# EAGLE design p0b-001 (EAGLE 9.6.2)
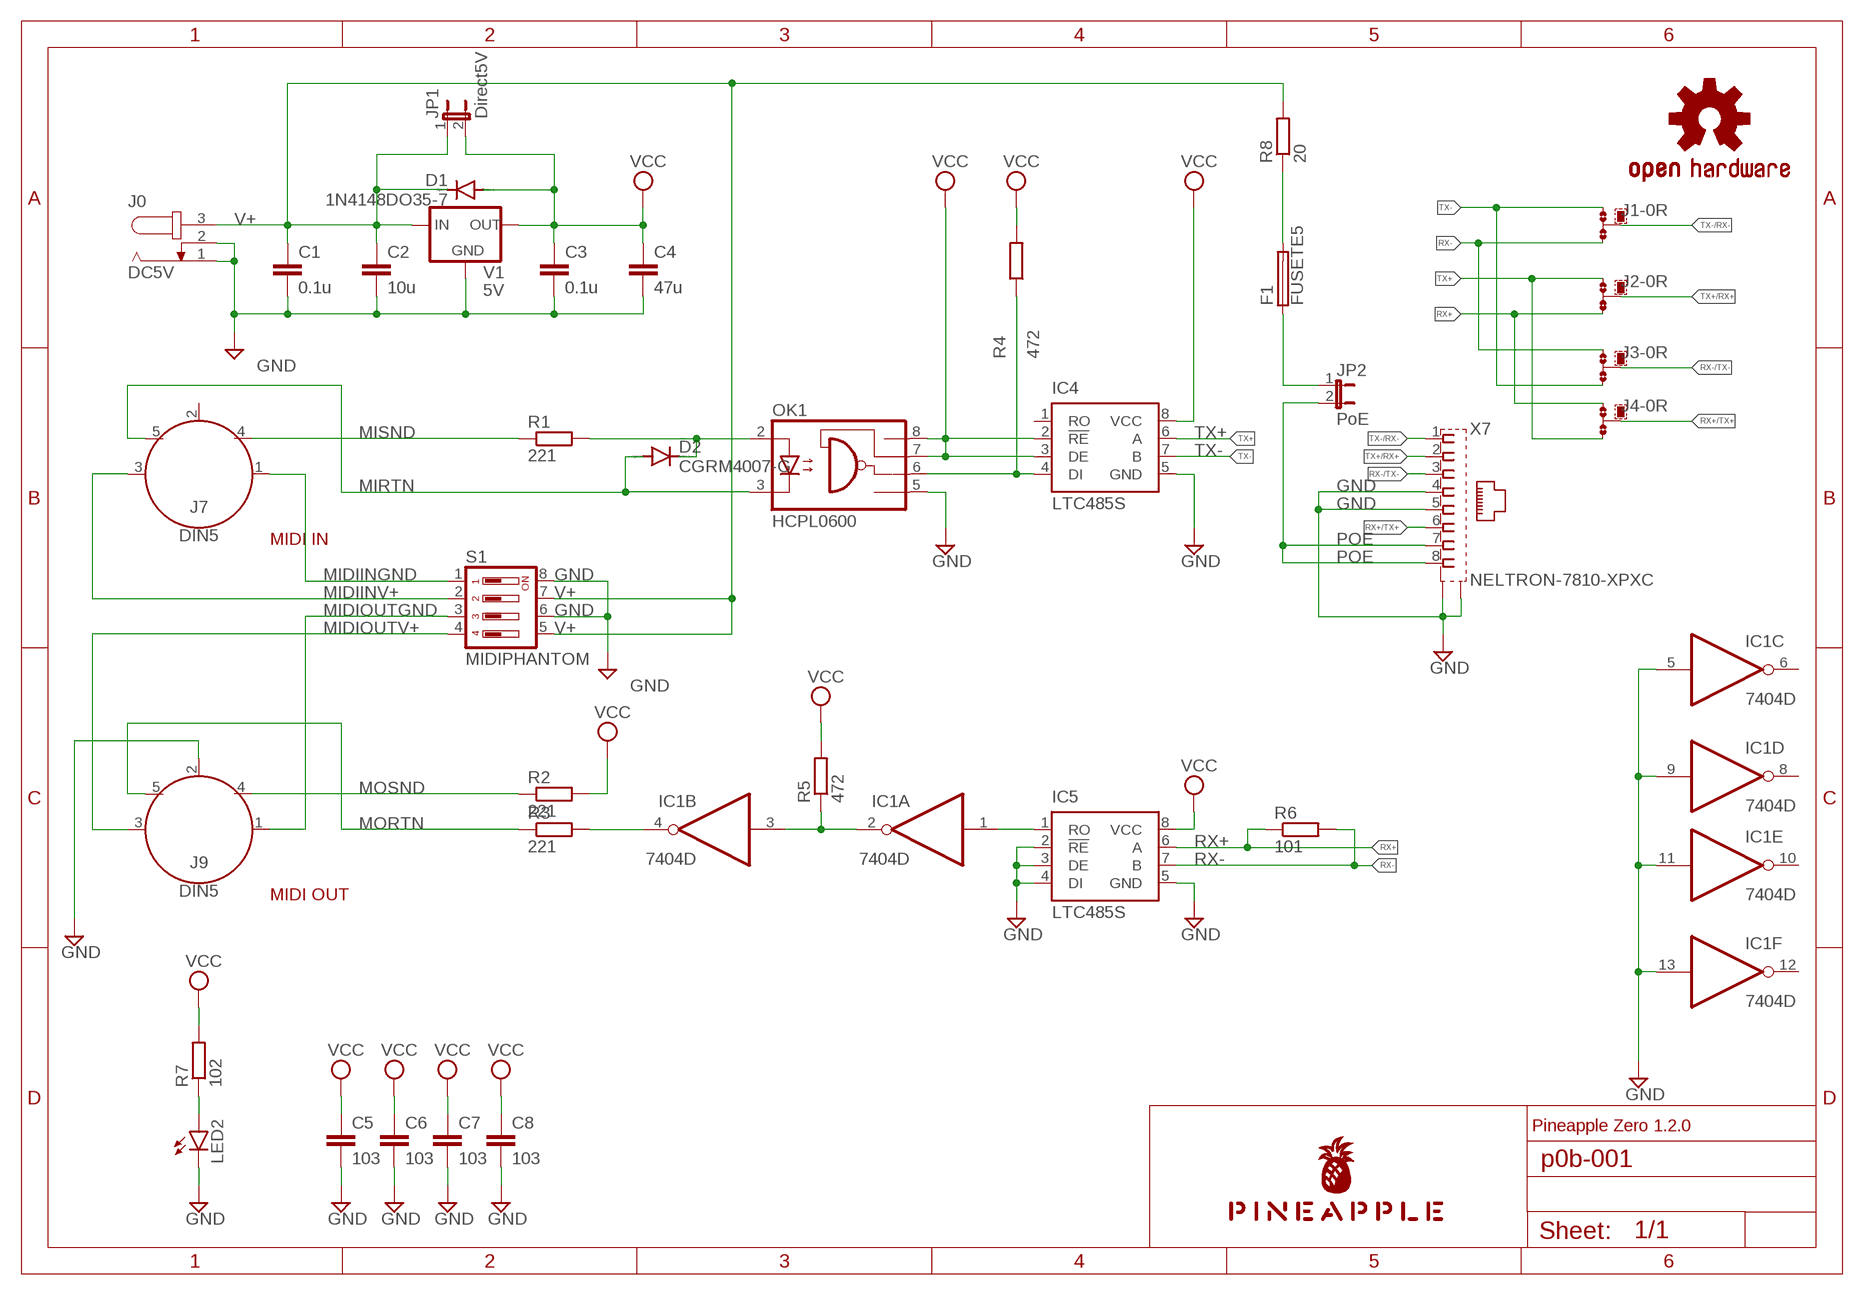
[diagram p0: schematic, sheet 1]

## Parts
C1  0.1u  C-EU025-025X050  [C025-025X050]
C2  10u  C-EU025-030X050  [C025-030X050]
C3  0.1u  C-EU025-025X050  [C025-025X050]
C4  47u  C-EU025-050X050  [C025-050X050]
C5  103  C-EUC1206  [C1206]
C6  103  C-EUC1206  [C1206]
C7  103  C-EUC1206  [C1206]
C8  103  C-EUC1206  [C1206]
D1  1N4148DO35-7  [DO35-7]
D2  CGRM4007-G  [SOD-123_MINI-SMA]
F1  FUSETE5  [TE5]
IC1  7404D  [SO14]
IC4  LTC485S  [SOIC8]
IC5  LTC485S  [SOIC8]
J0  DC5V  JACK-PLUG0  [SPC4077]
J1  0R-JUMPA  [A0R-JMP]
J2  0R-JUMPA  [A0R-JMP]
J3  0R-JUMPA  [A0R-JMP]
J4  0R-JUMPA  [A0R-JMP]
J7  DIN5  [DIN5-RA-PTH]
J9  DIN5  [DIN5-RA-PTH]
JP1  Direct5V  JP1E  [JP1]
JP2  PoE  JP1E  [JP1]
LED2  LEDCHIPLED_1206  [CHIPLED_1206]
LOGO1  OSHW-LOGOS-COPPER  [OSHW-LOGO-S_COPPER]
OK1  HCPL0600  [SOIC08]
R1  221  R-EU_M2012  [M2012]
R2  221  R-EU_M2012  [M2012]
R3  221  R-EU_M2012  [M2012]
R4  472  R-EU_M2012  [M2012]
R5  472  R-EU_M2012  [M2012]
R6  101  R-EU_M2012  [M2012]
R7  102  R-EU_M2012  [M2012]
R8  20  R-EU_0204/5  [0204/5]
S1  MIDIPHANTOM  DIP04YL  [DIP04YL]
U$1  PINEAPPLE450  [PINEAPPLE450]
V1  5V  78XXS  [78XXS]
X7  NELTRON-7810-XPXC  [NELTRON-7810-XPXC-FOOTPRINT]

## Nets
GND [gnd]: C1.2 C2.2 C3.2 C4.2 C5.2 C6.2 C7.2 C8.2 IC1.5(C:I) IC1.9(D:I) IC1.11(E:I) IC1.13(F:I) IC4.5(GND) IC5.2(!RE) IC5.3(DE) IC5.4(DI) IC5.5(GND) J0.1 J0.2 J9.2 LED2.C OK1.5(GND) S1.6 S1.8 V1.GND X7.4 X7.5 X7.S1 X7.S2
MIDIIN: D2.C OK1.2(A) R1.2
MIDIINGND [gnd]: J7.1 S1.1
MIDIINV+ [pwr]: J7.3 S1.2
MIDIOUT: IC1.4(B:O) R3.2
MIDIOUTGND [gnd]: J9.1 S1.3
MIDIOUTV+ [pwr]: J9.3 S1.4
MIRTN: D2.A J7.5 OK1.3(C)
MISND: J7.4 R1.1
MORTN: J9.5 R3.1
MOSND: J9.4 R2.1
N$4: LED2.A R7.1
NMIDIOUT: IC1.2(A:O) IC1.3(B:I) R5.1
POE [pwr]: JP2.2 X7.7 X7.8
POERAW [pwr]: F1.1 JP2.1
POERAW2 [pwr]: F1.2 R8.1
RX: IC1.1(A:I) IC5.1(RO)
RX+: IC5.6(A) J2.3 J4.1 R6.1
RX+/TX+: J4.2 X7.6
RX-: IC5.7(B) J1.3 J3.1 R6.2
RX-/TX-: J3.2 X7.3
TX: IC4.4(DI) OK1.6(VO) R4.1
TX+: IC4.6(A) J2.1 J4.3
TX+/RX+: J2.2 X7.2
TX-: IC4.7(B) J1.1 J3.3
TX-/RX-: J1.2 X7.1
V+ [pwr]: C1.1 C2.1 D1.C J0.3 JP1.1 R8.2 S1.5 S1.7 V1.IN
VCC [pwr]: C3.1 C4.1 C5.1 C6.1 C7.1 C8.1 D1.A IC4.2(!RE) IC4.3(DE) IC4.8(VCC) IC5.8(VCC) JP1.2 OK1.7(VE) OK1.8(VCC) R2.2 R4.2 R5.2 R7.2 V1.OUT
Unconnected: IC1.6(C:O) IC1.8(D:O) IC1.10(E:O) IC1.12(F:O) IC4.1(RO) J7.2

## Notes on the sheet
- MIDI IN
- MIDI OUT
- Pineapple Zero 1.2.0

## Power pins joined to a net without a drawn wire
GND: IC1.7(P:GND)
VCC: IC1.14(P:VCC)

## Library data of the parts
C1-C8 = rcl:C-EU: CAPACITOR, European symbol; SPICEPREFIX: C
D1 = diode:1N4148: DIODE high speed (Philips)
D2 = diode:CGRM400*-G: Molded plasitc,JEDEC SOD-123/Mini SMA Source: Comchip CGRM4001-G.pdf
F1 = fuse:FUSE: Fuse; OC_FARNELL: unknown; OC_NEWARK: unknown
IC1 = 74xx-us:74*04: Hex INVERTER
IC4 IC5 = linear-technology:LTC485: Low Power RS485 Interface Transceiver Source: http://www.linear.com/pc/downloadDocument.do?navId=H0,C1,C1007,C1017,P2064,D1718; OC_FARNELL: unknown; OC_NEWARK: unknown
J0 = con-jack:JACK-PLUG: DC POWER JACK Power Jack, DC, Right Angle, Through Hole, Rated 5A at 16VDC, PC Terminals Distributor: Farnell (www.Farnell.de) Drawing: 84N1161.pdf / 84N1162.pdf Manufacturer: SPC Technology (www.spctechnology.com) Type: SPC4077 / SPC 4078; OC_FARNELL: unknown; OC_NEWARK: unknown
J1-J4 = jump-0r-smd:0R-JUMP: SMD 0R 0805 Jumper
J7 J9 = SparkFun-Connectors:DIN5: DIN5 Connector - Female Right Angle (frequently used as a MIDI Jack connector) This type of connector and cable is frequently used for transmitting midi data (musical instrument digital interface). It is what you usually see on a keyboard or set of electronic drums. Learn more here <https://en.wikipedia.org/wiki/MIDI>. For more information on the pinout and electrical specifications of MIDI communications, please see the following resource: https://www.midi.org/specifications/item/midi-din-electrical-specification Here is the connector we sell at SparkFun: MIDI Connector - Female Right Angle <https://www.sparkfun.com/products/9536> (PRT-09536) Datasheet <hhttp://www.sparkfun.com/datasheets/Prototyping/Connectors/MIDI-RA.pdf> It is used on this SparkFun product: SparkFun MIDI Shield <https://www.sparkfun.com/products/12898> (DEV-12898); PROD_ID: CONN-09481
JP1 JP2 = jumper:JP1E: JUMPER
LED2 = led:LED: LED OSRAM: - CHIPLED LG R971, LG N971, LY N971, LG Q971, LY Q971, LO R971, LY R971 LH N974, LH R974 LS Q976, LO Q976, LY Q976 LO Q996 - Hyper CHIPLED LW Q18S LB Q993, LB Q99A, LB R99A - SideLED LS A670, LO A670, LY A670, LG A670, LP A670 LB A673, LV A673, LT A673, LW A673 LH A674 LY A675 LS A676, LA A676, LO A676, LY A676, LW A676 LS A679, LY A679, LG A679 - Hyper Micro SIDELED® LS Y876, LA Y876, LO Y876, LY Y876 LT Y87S - SmartLED LW L88C, LW L88S LB L89C, LB L89S, LG L890 LS L89K, LO L89K, LY L89K LS L896, LA L896, LO L896, LY L896 - TOPLED LS T670, LO T670, LY T670, LG T670, LP T670 LSG T670, LSP T670, LSY T670, LOP T670, LYG T670 LG T671, LOG T671, LSG T671 LB T673, LV T673, LT T673, LW T673 LH T674 LS T676, LA T676, LO T676, LY T676, LB T676, LH T676, LSB T676, LW T676 LB T67C, LV T67C, LT T67C, LS T67K, LO T67K, LY T67K, LW E67C LS E67B, LA E67B, LO E67B, LY E67B, LB E67C, LV E67C, LT E67C LW T67C LS T679, LY T679, LG T679 LS T770, LO T770, LY T770, LG T770, LP T770 LB T773, LV T773, LT T773, LW T773 LH T774 LS E675, LA E675, LY E675, LS T675 LS T776, LA T776, LO T776, LY T776, LB T776 LHGB T686 LT T68C, LB T68C - Hyper Mini TOPLED® LB M676 - Mini TOPLED Santana® LG M470 LS M47K, LO M47K, LY M47K Source: http://www.osram.convergy.de LUXEON: - LUMILED® LXK2-PW12-R00, LXK2-PW12-S00, LXK2-PW14-U00, LXK2-PW14-V00 LXK2-PM12-R00, LXK2-PM12-S00, LXK2-PM14-U00 LXK2-PE12-Q00, LXK2-PE12-R00, LXK2-PE12-S00, LXK2-PE14-T00, LXK2-PE14-U00 LXK2-PB12-K00, LXK2-PB12-L00, LXK2-PB12-M00, LXK2-PB14-N00, LXK2-PB14-P00, LXK2-PB14-Q00 LXK2-PR12-L00, LXK2-PR12-M00, LXK2-PR14-Q00, LXK2-PR14-R00 LXK2-PD12-Q00, LXK2-PD12-R00, LXK2-PD12-S00 LXK2-PH12-R00, LXK2-PH12-S00 LXK2-PL12-P00, LXK2-PL12-Q00, LXK2-PL12-R00 Source: www.luxeon.com KINGBRIGHT: KA-3528ASYC Source: www.kingbright.com
LOGO1 = SparkFun-Aesthetics:OSHW-LOGO: Open-Source Hardware (OSHW) Logo This logo indicates the piece of hardware it is found on incorporates a OSHW license and/or adheres to the definition of open source hardware found here: http://freedomdefined.org/OSHW
OK1 = optocoupler:HCPL0600: HEWLETT PACKARD OPTO COUPLER; MF: AGILENT TECHNOLOGIES; MPN: HCPL-0600-000E; OC_FARNELL: 9994696; OC_NEWARK: 88H7774
R1-R8 = rcl:R-EU_: RESISTOR, European symbol; SPICEPREFIX: R
S1 = switch-dil:DIP04YL: DIL/CODE SWITCH; OC_FARNELL: unknown; OC_NEWARK: unknown
U$1 = pineapple:PINEAPPLE450
V1 = v-reg:78XXS: VOLTAGE REGULATOR
X7 = con-rj45:NELTRON-7810-XPXC: Mod. Jack, Right Angle, 8 posiotion, 8 contatcs RJ45 Source: GLX-S-88M.pdf

## Net classes
0 default: width 0.152 mm, drill 0.152 mm, clearance 0.152 mm
1 pwr: width 0.305 mm, drill 0.152 mm, clearance 0.152 mm
2 gnd: width 0.305 mm, drill 0.152 mm, clearance 0.152 mm

## Board
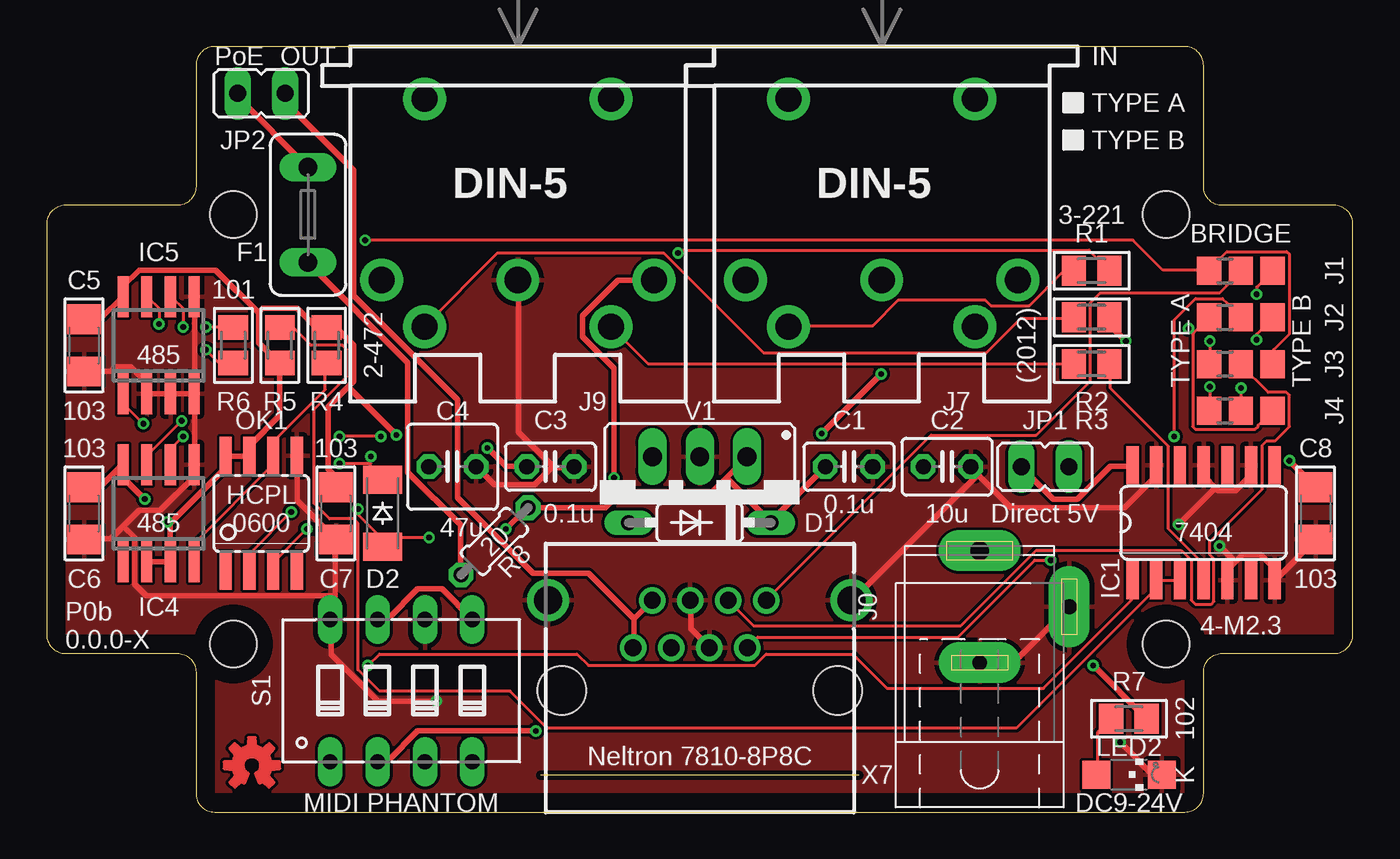
[diagram p1: board, top side]
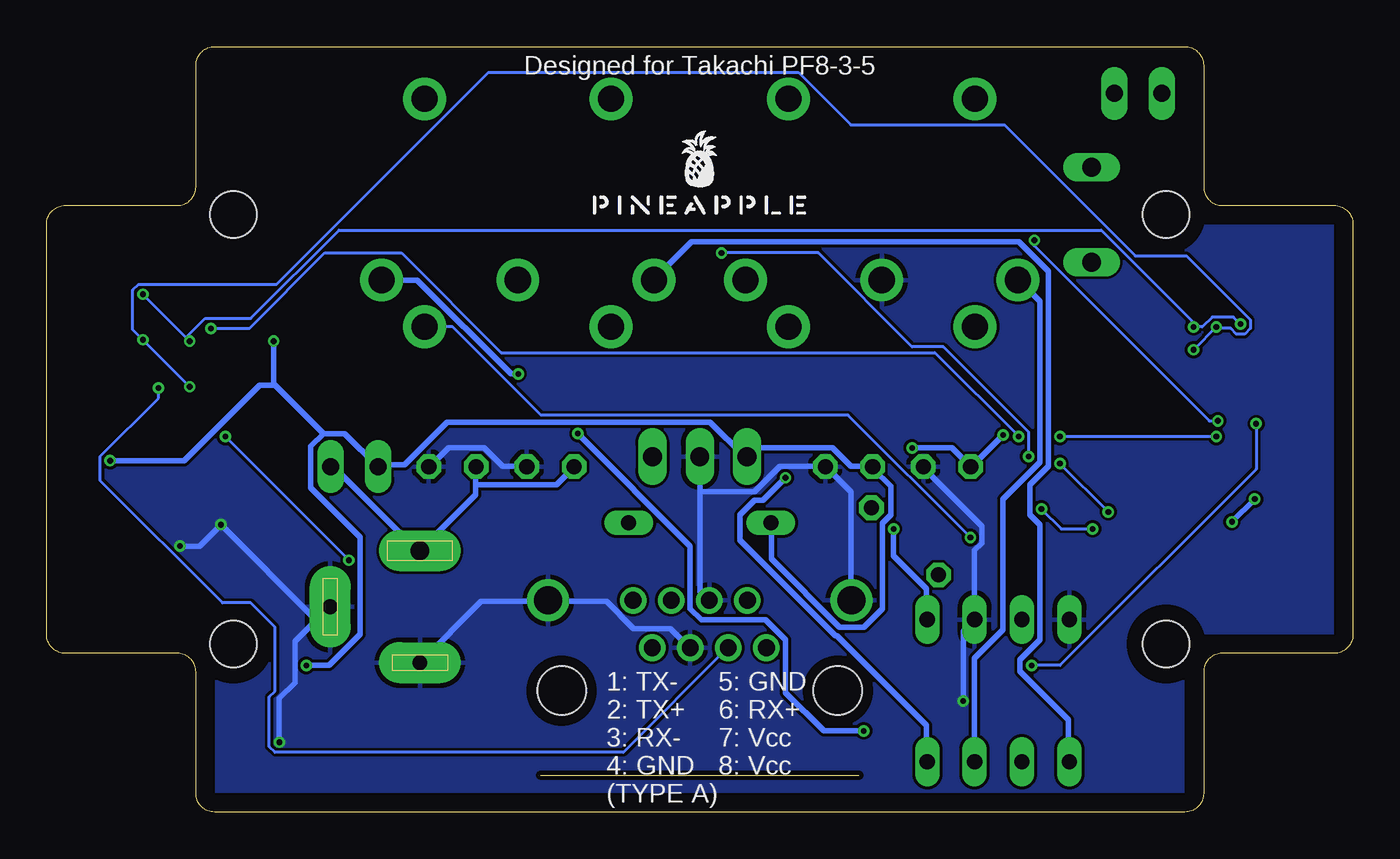
[diagram p2: board, bottom side, seen from below]

Size 70 x 41 mm. Coordinates in mm from the lower left corner, seen from the top.
Outline: 1,8.5 7,8.5 arc-90 8,7.5 8,1 arc90 9,0 61,0 arc90 62,1 62,7.5 arc-90 63,8.5 69,8.5 arc90 70,9.5 70,31.5 arc90 69,32.5 63,32.5 arc-90 62,33.5 62,40 arc90 61,41 9,41 arc90 8,40 8,33.5 arc-90 7,32.5 1,32.5 arc90 0,31.5 0,9.5 arc90 1,8.5
Copper layers (1*16): Top 0.035mm / dielectric 1.5mm / Bottom 0.035mm
Design rules "SeeedStudio_2layer_DRU_no_angle_20140221": minimum track width 6mil, minimum drill 12mil, track to track 6mil, track to pad 6mil, pad to pad 6mil, via to via 6mil, smd to smd 0mil, copper to edge 10mil, drill to drill 10mil, minimum pad ring 10mil, minimum via ring 6mil, stop-mask expansion 2mil, vias tented up to drill 100mil, thermal gap 10mil
Holes 2.5 mm at 10,9 60,9 60,32 10,32
tRestrict: area 0,8.5 to 1,32.5; area 0,31.5 to 9,32.5; area 8,31.5 to 9,41; area 8,40 to 62,41; area 61,31.5 to 62,41; area 61,31.5 to 70,32.5; area 69,8.5 to 70,32.5; area 61,8.5 to 70,9.5; area 61,0 to 62,9.5; area 8,0 to 62,1; area 8,0 to 9,9.5; area 0,8.5 to 9,9.5; 4 more areas
bRestrict: area 8,40 to 62,41; area 69,8.5 to 70,32.5; area 8,0 to 62,1; area 0,8.5 to 1,32.5; area 8,7 to 12,11; area 8,31.5 to 9,41; area 61,31.5 to 62,41; area 8,0 to 9,9.5; area 61,0 to 62,9.5; area 0,31.5 to 9,32.5; area 0,8.5 to 9,9.5; area 61,8.5 to 70,9.5; 5 more areas

### Footprints (pad centres in the part's own frame; a part is rotated, then mirrored left to right if it is on the bottom)
C025-025X050 = drill 0.813 octagon: 1 -1.27,0; 2 1.27,0
C025-030X050 = drill 0.813 octagon: 1 -1.27,0; 2 1.27,0
C025-050X050 = drill 0.813 octagon: 1 -1.27,0; 2 1.27,0
C1206 = smd 1.6 x 1.8: 1 -1.4,0; 2 1.4,0
DO35-7 = drill 0.813 long: A 3.81,0; C -3.81,0
SOD-123_MINI-SMA = smd 1.5 x 2.1: A 1.8,0; C -1.8,0
TE5 = drill 1.016 long: 1 -2.54,0; 2 2.54,0
SO14 = smd 0.66 x 2.032: 1 -3.81,-3.073; 2 -2.54,-3.073; 3 -1.27,-3.073; 4 0,-3.073; 5 1.27,-3.073; 6 2.54,-3.073; 7 3.81,-3.073; 8 3.81,3.073; 9 2.54,3.073; 10 1.27,3.073; 11 0,3.073; 12 -1.27,3.073; 13 -2.54,3.073; 14 -3.81,3.073
SOIC8 = smd 0.6 x 2.2: 1 -1.905,-2.6; 2 -0.635,-2.6; 3 0.635,-2.6; 4 1.905,-2.6; 5 1.905,2.6; 6 0.635,2.6; 7 -0.635,2.6; 8 -1.905,2.6
SPC4077 = drill 0.8 pad 2.184 long: 1 -3,0; 2 0,-4.8 | drill 1 pad 2.184 long: 3 3,0
A0R-JMP = smd 1.5 x 1.3: 1 0,1.7; 2 0,0; 3 0,-1.7
DIN5-RA-PTH = drill 1.4 pad 2.286: 1 7.3,12.5; 2 0,12.5; 3 -7.3,12.5; 4 5,15; 5 -5,15; 6 -5,2.8; 7 5,2.8
JP1 = drill 0.914 long: 1 0,-1.27; 2 0,1.27
CHIPLED_1206 = smd 1.5 x 1.5: A 0,-1.75; C 0,1.75
SOIC08 = smd 0.66 x 2.032: 1 -1.905,-3.073; 2 -0.635,-3.073; 3 0.635,-3.073; 4 1.905,-3.073; 5 1.905,3.073; 6 0.635,3.073; 7 -0.635,3.073; 8 -1.905,3.073
M2012 = smd 1.3 x 1.6: 1 -0.95,0; 2 0.95,0
0204/5 = drill 0.813 octagon: 1 -2.54,0; 2 2.54,0
DIP04YL = drill 0.813 long: 1 -3.81,-3.81; 2 -1.27,-3.81; 3 1.27,-3.81; 4 3.81,-3.81; 5 3.81,3.81; 6 1.27,3.81; 7 -1.27,3.81; 8 -3.81,3.81
78XXS = drill 1.016 long: GND 0,-2.54; IN -2.54,-2.54; OUT 2.54,-2.54
NELTRON-7810-XPXC-FOOTPRINT = drill 0.9 pad 1.422: 1 -3.57,-4.84; 2 -2.55,-2.3; 3 -1.53,-4.84; 4 -0.51,-2.3; 5 0.51,-4.84; 6 1.53,-2.3; 7 2.55,-4.84; 8 3.57,-2.3 | drill 1.5 pad 2.184: S1 -8.125,-4.84; S2 8.125,-4.84 | hole 2.6: -7.4,0; 7.4,0

### Placement (x,y rotation side)
C1  43,18.5 0 top
C2  48.25,18.5 0 top
C3  27,18.5 0 top
C4  21.75,18.5 0 top
C5  2,25 270 top
C6  2,16 270 top
C7  15.5,16 270 top
C8  68,16 270 top
D1  35,15.5 180 top
D2  18,16 270 top
F1  14,32 270 top
IC1  62,15.5 0 top
IC4  6,16 0 top
IC5  6,25 0 top
J0  50,11 90 top
J1  64,29 90 top
J2  64,26.5 90 top
J3  64,24 90 top
J4  64,21.5 90 top
J7  44.75,41 180 top
J9  25.25,41 180 top
JP1  53.5,18.5 90 top
JP2  11.5,38.5 270 top
LED2  58,2 270 top
LOGO1  11,2.5 0 top
OK1  11.5,16 0 top
R1  56,29 0 top
R2  56,26.5 0 top
R3  56,24 0 top
R4  15,25 90 top
R5  12.5,25 270 top
R6  10,25 90 top
R7  58,5 0 top
R8  24,14.5 45 top
S1  19,6.5 0 top
U$1  35,32 0 bottom
V1  35,16.5 180 top
X7  35,6.5 180 top

### Tracks (layer width: path | path; a pad name or v marks a point on that pad's centre or on a via)
GND  (via drill 0.3)
  Top 0.305: IC1.13 59.44,18.52 59.44,17.98 57.76,16.31 51.66,16.31 49.53,18.44 C2.2 49.84,17.98 43.13,11.28 X7.S1 | C8.2 67.97,14.55 65.84,12.42 IC1.7 66.06,12.8 65.08,13.79 64.08,13.79 63.7,13.41 | 63.7,13.41 63.32,13.03 63.32,12.5 IC1.5 | 62.64,17.37 62.79,17.22 63.7,17.22 64.47,17.98 64.47,18.52 IC1.9 | 62.64,17.37 62.03,17.98 62.03,18.52 IC1.11 | v57.53,3.73 59.21,2.06 59.74,2.06 LED2.C | v60.66,15.39 62.64,17.37 | v62.87,14.25 63.7,13.41 | J0.1 50.06,8 51.82,8 54.79,10.97 J0.2 | S1.8 15.24,10.36 15.47,10.59 15.47,14.55 C7.2 15.39,14.71 13.41,16.69 13.41,19.05 OK1.5 | 4.12,15.32 4.95,16.15 6.1,16.15 7.85,17.91 7.85,18.59 IC4.5 7.92,18.75 7.92,22.25 IC5.4 | 4.12,15.32 3.43,14.63 2.06,14.63 C6.2 | C5.2 2.06,23.62 3.43,23.62 3.66,23.85 4.5,23.85 5.33,23.01 5.33,22.4 IC5.2 5.49,22.4 6.55,22.4 IC5.3 6.71,22.4 7.85,22.4 IC5.4 | IC5.5 7.92,27.58 7.92,22.48 IC5.4 | 4.12,15.32 4.72,14.71 4.72,12.19 5.33,11.58 15.39,11.58 S1.8 | X7.5 34.52,11.28 34.52,9.83 35.51,8.84 X7.4 | 27.13,18.44 27.05,18.44 26.14,17.53 24,17.53 23.09,18.44 C4.2 | 27.13,18.44 28.19,18.44 C3.2 | J9.2 25.3,28.5 25.3,20.34 27.13,18.52 27.13,18.44 | v20.88,5.94 17.75,5.94 15.24,8.46 15.24,10.21 S1.8
  Bottom 0.305: C1.2 44.27,18.52 45.57,18.52 46.56,19.51 48.46,19.51 49.45,18.52 C2.2 | v57.53,3.73 57.53,6.1 56.69,6.93 56.69,9.14 54.86,10.97 J0.2 55.63,10.36 v60.66,15.39 61.8,14.25 v62.87,14.25 | J0.1 49.99,8 46.71,11.28 43.13,11.28 X7.S1 42.98,11.28 40.01,11.28 38.56,9.83 36.58,9.83 35.59,8.84 X7.4 | 34.98,17.14 34.98,11.81 34.52,11.35 X7.5 | 34.98,17.14 34.98,18.97 V1.GND | C4.2 23.01,18.44 19.89,15.32 19.89,14.4 20.27,14.02 20.27,10.36 S1.6 20.34,10.21 20.88,9.68 v20.88,5.94 | X7.S2 26.9,11.35 26.9,17.14 28.19,18.44 C3.2 28.42,18.52 30.71,18.52 32.08,17.14 34.98,17.14
  pour Top: -0.5,-0.5 70.5,-0.5 70.5,41.5 -0.5,41.5
  pour Bottom: -1,-1 71,-1 71,42 -1,42
MIDIIN  (via drill 0.3)
  Top 0.152: v33.83,29.95 33.98,30.1 55.85,30.1 56.92,29.03 R1.2 | 17.37,18.67 17.37,18.44 17.98,17.83 D2.C | 17.37,18.67 v17.37,19.05 | v13.11,16.08 10.9,13.87 10.9,12.95 OK1.2 | 17.37,18.67 v15.7,18.67
  Bottom 0.152: v33.83,29.95 28.65,29.95 23.62,24.92 21.95,24.92 17.37,20.34 v17.37,19.05 | v15.7,18.67 v13.11,16.08
MIDIINGND
  Bottom 0.305: S1.1 15.24,2.74 15.24,4.95 17.83,7.54 17.83,8.15 16.76,9.22 16.76,15.39 17.3,15.93 17.3,17.53 16.31,18.52 16.31,28.96 17.91,30.56 35.43,30.56 37.41,28.57 J7.1
MIDIINV+  (via drill 0.3)
  Top 0.305: v26.21,4.34 19.89,4.34 18.29,2.74 17.75,2.74 S1.2 | v44.73,23.47 v41.53,20.27
  Bottom 0.305: v26.21,4.34 28.35,4.34 30.4,6.4 30.4,9.22 31.47,10.29 34.9,10.29 35.51,10.9 35.51,14.25 v41.53,20.27 | v44.73,23.47 45.11,23.47 50.14,28.5 J7.3
MIDIOUT
  Top 0.152: R3.2 57,23.93 57,22.71 60.12,19.58 60.12,15.16 61.95,13.34 61.95,12.5 IC1.4
MIDIOUTGND
  Bottom 0.305: S1.3 20.27,2.74 20.27,8.23 18.75,9.75 18.75,16.76 16.76,18.75 16.76,27.36 17.91,28.5 J9.1
MIDIOUTV+  (via drill 0.3)
  Top 0.305: v30.4,17.91 30.4,23.77 28.73,25.45 28.73,26.59 30.63,28.5 32.54,28.5 J9.3
  Bottom 0.305: v30.4,17.91 31.62,16.69 32.08,16.69 32.84,15.93 32.84,14.55 27.74,9.45 27.66,9.45 22.86,4.65 22.86,2.74 S1.4
MIRTN  (via drill 0.3)
  Top 0.152: v13.95,15.16 12.19,13.41 12.19,12.95 OK1.3 | v16.69,16.23 16.69,15.93 17.98,14.63 17.98,14.25 D2.A 17.98,14.71 v20.5,14.71
  Bottom 0.152: v13.95,15.16 15.62,15.16 v16.69,16.23 | v20.5,14.71 27.05,21.26 43.51,21.26 48.23,25.98 49.68,25.98 J7.5
MISND
  Top 0.152: R1.1 55.02,28.96 54.48,28.96 52.65,27.13 50.6,27.13 50.29,27.43 45.64,27.43 44.27,26.06 39.78,26.06 J7.4
MORTN
  Top 0.152: R3.1 55.02,24 32.23,24 30.25,25.98 J9.5
MOSND
  Top 0.152: R2.1 55.02,26.44 52.2,26.44 50.37,24.61 38.41,24.61 33.07,29.95 24.16,29.95 20.27,26.06 J9.4
N$4
  Top 0.152: LED2.A 56.31,2.06 56.31,4.27 57,4.95 R7.1
NMIDIOUT
  Top 0.152: R5.1 12.57,25.91 13.26,25.91 14.17,24.99 15.85,24.99 16.08,24.77 16.08,23.32 14.33,21.57 14.33,16.54 15.16,15.7 16.46,15.7 16.69,15.47 16.69,7.62 17.83,6.48 24.84,6.48 26.82,4.5 51.97,4.5 59.44,11.96 59.44,12.42 IC1.2 59.51,12.42 60.66,12.42 IC1.3
POE
  Top 0.305: 31.47,10.36 31.47,8.84 X7.8 | 31.47,10.36 32.38,11.28 X7.7 | 31.47,10.36 29.03,12.8 26.06,12.8 22.02,16.84 22.02,22.1 16.46,27.66 16.46,34.37 12.8,38.02 12.8,38.48 JP2.2
POERAW
  Top 0.305: JP2.1 10.29,38.48 10.29,38.25 13.95,34.59 F1.1
POERAW2
  Top 0.305: R8.1 22.17,12.72 22.17,15.39 19.36,18.21 19.36,24.08 14.02,29.41 F1.2
RX  (via drill 0.3)
  Top 0.152: v17.22,7.85 17.83,8.46 28.42,8.46 29.03,7.85 37.95,7.85 38.56,8.46 43.2,8.46 45.03,6.63 53.42,6.63 58.14,11.35 58.14,12.42 IC1.1 | v5.18,20.8 4.12,21.87 4.12,22.33 IC5.1
  Bottom 0.152: v17.22,7.85 15.7,7.85 5.18,18.36 v5.18,20.8
RX+  (via drill 0.3)
  Top 0.152: v8.53,24.77 9.22,24.08 9.98,24.08 R6.1 | v7.32,25.98 7.32,26.98 6.71,27.58 IC5.6 | v62.33,22.78 62.33,21.57 J4.1 | v64.85,25.3 64.85,25.6 65.68,26.44 J2.3
  Bottom 0.152: v8.53,24.77 v7.32,25.98 7.32,25.91 6.55,25.91 6.25,25.6 5.79,25.6 5.49,25.91 5.49,26.36 8.91,29.79 11.66,29.79 18.67,36.8 26.9,36.8 29.72,39.62 46.33,39.62 57.68,28.27 65.08,28.27 65.38,27.96 65.38,25.83 v64.85,25.3 v62.33,22.78
RX+/TX+  (via drill 0.3)
  Top 0.152: v64.01,22.71 64.01,21.57 J4.2
  Bottom 0.152: v64.01,22.71 64.01,22.17 67.13,19.05 67.13,17.75 60.58,11.2 59.05,11.2 57.76,9.91 57.76,6.48 58.06,6.17 58.06,3.5 57.76,3.2 39.09,3.2 33.53,8.76 X7.6
RX-  (via drill 0.3)
  Top 0.152: v8.53,25.98 9.98,25.98 R6.2 | v6.02,26.14 6.02,26.98 5.41,27.58 IC5.7 | v62.33,25.22 62.33,24 J3.1 | v64.85,27.74 64.85,28.12 65.68,28.96 J1.3
  Bottom 0.152: v6.02,26.14 6.4,26.52 7.54,26.52 8.08,25.98 v8.53,25.98 8.53,26.21 13.49,31.17 54.33,31.17 59.05,26.44 61.49,26.44 62.48,25.45 v62.33,25.22 v64.85,27.74
RX-/TX-
  Top 0.152: J3.2 64.01,23.93 65.46,22.48 66.45,22.48 66.6,22.33 66.6,20.65 65.84,19.89 65.38,19.89 65.15,19.66 65.15,17.3 62.33,14.48 62.33,13.79 62.56,13.56 62.56,11.28 62.41,11.12 61.57,11.12 61.34,11.35 61.34,13.49 60.81,14.02 53.03,14.02 49,9.98 37.87,9.98 36.58,11.28 X7.3
TX
  Top 0.152: R4.1 14.94,24 14.94,22.63 12.19,19.89 12.19,19.13 OK1.6 12.12,19.05 12.12,18.59 7.92,14.4 7.92,13.41 IC4.4
TX+  (via drill 0.3)
  Top 0.152: 61.45,25.64 62.26,26.44 J2.1 | 61.45,25.64 61.42,25.6 61.42,20.65 61.57,20.5 64.77,20.5 64.92,20.65 64.92,20.73 65.68,21.49 J4.3 | v7.32,20.12 6.71,19.51 6.71,18.67 IC4.6 | v17.91,20.12 v15.7,20.12 | 61.45,25.64 v61.19,25.91
  Bottom 0.152: v15.7,20.12 v7.32,20.12 | v17.91,20.12 22.4,24.61 45.64,24.61 50.98,29.95 55.09,29.95 59.13,25.91 v61.19,25.91
TX+/RX+  (via drill 0.3)
  Top 0.152: v60.43,20.12 60.43,26.36 61.57,27.51 63.02,27.51 63.25,27.28 63.25,27.2 63.93,26.52 J2.2 | v53.8,13.49 52.96,13.49 48.84,9.37 38.1,9.37 37.57,8.84 X7.2
  Bottom 0.152: v53.8,13.49 v60.43,20.12
TX-  (via drill 0.3)
  Top 0.152: J3.3 65.76,24 65.76,24.77 66.6,25.6 66.6,29.87 66.45,30.02 63.25,30.02 62.26,29.03 J1.1 62.18,29.03 59.82,29.03 58.22,30.63 v17.07,30.63 | v7.24,20.95 5.41,19.13 5.41,18.67 IC4.7
  Bottom 0.152: v7.24,20.95 7.7,20.95 17.07,30.33 v17.07,30.63
TX-/RX-
  Top 0.152: J1.2 63.93,28.96 63.25,28.27 63.25,28.19 62.87,27.81 56.46,27.81 55.93,27.28 55.93,23.09 53.03,20.19 47.4,20.19 38.56,11.35 X7.1
V+  (via drill 0.3)
  Top 0.305: S1.7 17.75,10.36 18.29,10.36 19.89,11.96 21.18,11.96 22.78,10.36 S1.5 | 36.42,17.91 37.49,18.97 V1.IN | 36.42,17.91 35.66,17.14 30.79,17.14 29.95,16.31 25.83,16.31 R8.2 25.68,16.23 v24.61,15.16 | 36.42,17.91 38.79,15.54 D1.C 38.86,15.62 41.68,18.44 C1.1
  Bottom 0.305: 47.02,17.53 47.02,16.99 49.99,14.02 J0.3 50.14,14.02 54.56,18.44 54.71,18.44 JP1.1 | 47.02,17.53 47.02,18.44 C2.1 | v24.61,15.16 24.61,13.72 22.86,11.96 22.86,10.36 S1.5 | 47.02,17.53 42.67,17.53 41.76,18.44 C1.1
VCC  (via drill 0.3)
  Top 0.305: v56.08,7.85 58.9,5.03 R7.2 | v57.84,25.22 57,26.06 57,26.44 R2.2 | v66.6,18.82 67.97,17.45 C8.1 | IC1.14 58.14,18.52 57,18.52 55.24,16.76 53.95,16.76 52.27,18.44 JP1.2 | C5.1 2.06,26.44 2.9,26.44 4.04,27.58 IC5.8 4.12,27.74 4.12,28.19 4.95,29.03 9.07,29.03 11.35,26.75 | C6.1 2.06,17.45 2.9,17.45 4.04,18.59 IC4.8 3.81,18.21 v5.26,16.76 | IC4.2 5.41,13.41 IC4.3 6.63,13.56 6.63,15.47 | 11.35,26.75 11.58,26.98 13.41,26.98 14.4,25.98 14.94,25.98 R4.2 15.09,25.83 15.62,25.83 16.46,24.99 16.46,23.09 16.15,22.78 | 11.35,26.75 11.35,25.15 12.42,24.08 R5.2 12.5,24 12.5,21.26 10.9,19.66 10.9,19.13 OK1.7 10.74,19.05 9.6,19.05 OK1.8 9.6,18.9 9.6,18.44 6.63,15.47 | 16.15,22.78 15.09,21.72 15.09,18.36 15.47,17.98 15.47,17.45 C7.1 | 16.15,22.78 v18.75,20.19 | v6.48,15.54 6.55,15.54 6.63,15.47 | v23.62,19.51 24.61,18.52 25.68,18.52 C3.1
  Bottom 0.305: v56.08,7.85 54.86,7.85 53.19,9.53 53.19,14.71 55.85,17.37 55.85,19.58 55.17,20.27 | 55.17,20.27 54.03,20.27 52.27,18.52 JP1.2 52.12,18.59 50.83,18.59 48.54,20.88 34.44,20.88 32.61,19.05 V1.OUT 32.38,19.05 31.93,19.51 27.89,19.51 26.9,18.52 25.76,18.52 C3.1 25.68,18.36 24.77,17.45 24.77,15.93 25.22,15.47 25.22,10.9 26.21,9.91 27.51,9.91 31.17,13.56 31.17,15.47 D1.A | 57.84,22.94 v57.84,25.22 | 55.17,20.27 57.84,22.94 | v66.6,18.82 62.64,18.82 58.6,22.86 57.91,22.86 57.84,22.94 | v18.75,20.19 20.42,18.52 C4.1 20.57,18.59 21.49,19.51 v23.62,19.51 | v6.48,15.54 v5.26,16.76

### Text on the board
tPlace: TYPE A | TYPE B
tNames: PoE | OUT | IN | 3-221 | BRIDGE | 101 | 2-472 | (2012) | TYPE A | TYPE B | 485 | 103 | 103 | 103 | HCPL | 485 | 0600 | 0.1u | 0.1u | 10u | Direct 5V | 47u | 7404 | 20 | 103 | P0b / 0.0.0-X | 4-M2.3 | 102 | Neltron 7810-8P8C | K | MIDI PHANTOM | DC9-24V
bNames: Designed for Takachi PF8-3-5 | 5: GND / 6: RX+ / 7: Vcc / 8: Vcc | 1: TX- / 2: TX+ / 3: RX- / 4: GND / (TYPE A)